# EAGLE design bluetoot_relay (EAGLE 7.4.0)
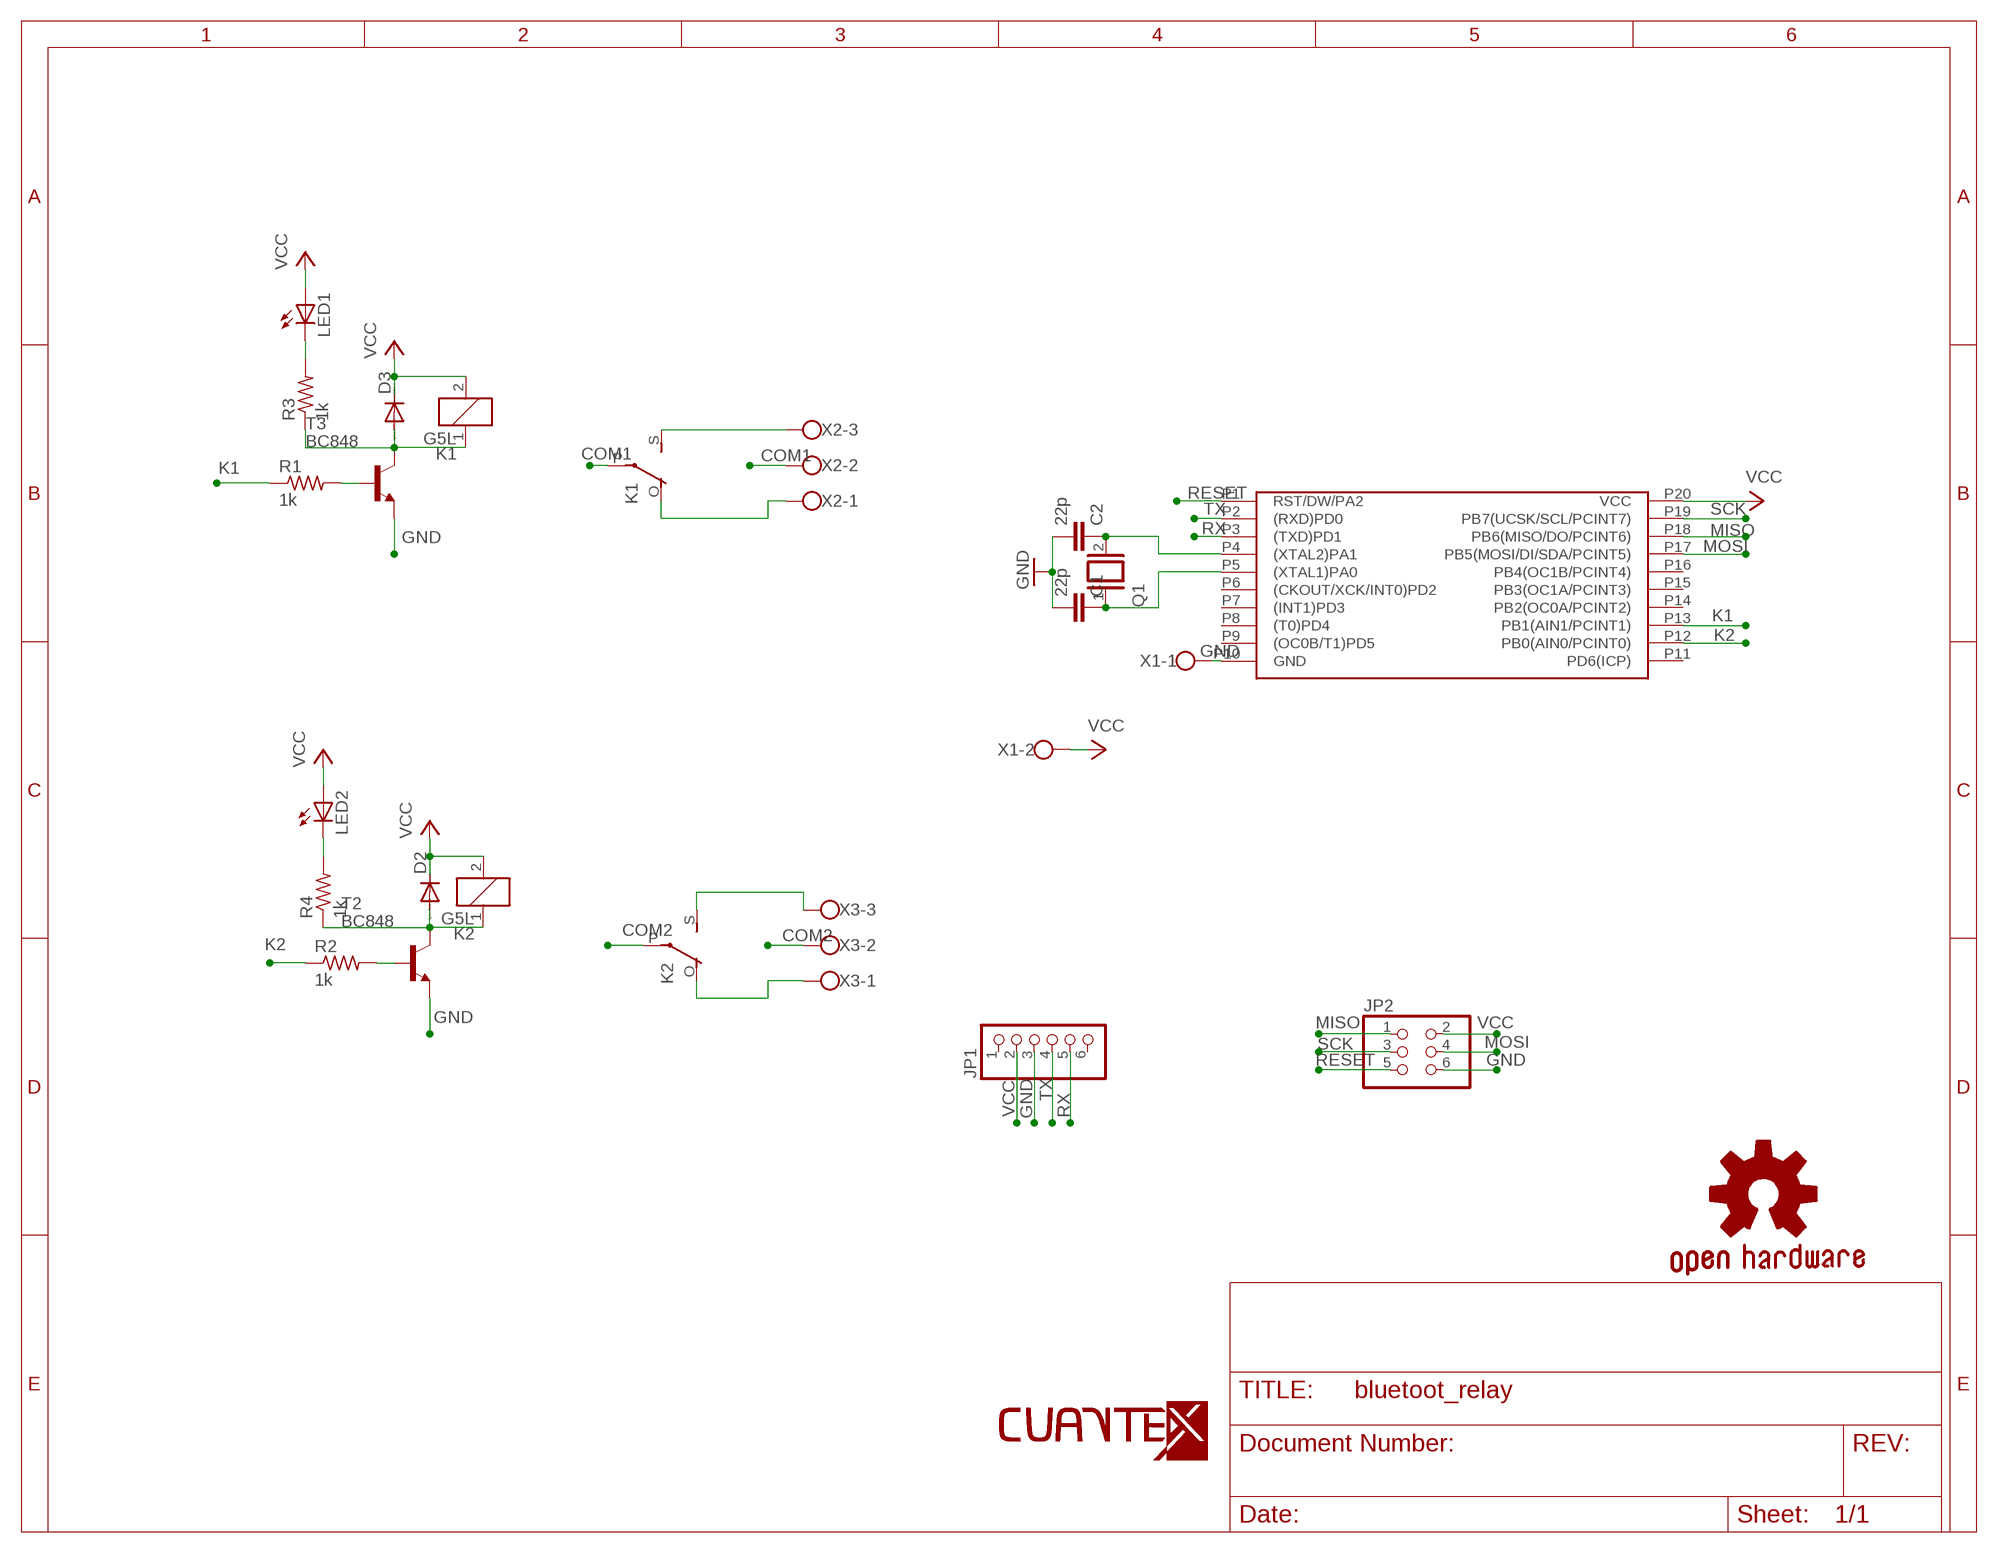
[diagram p0: schematic, sheet 1]

## Parts
C1  22p  C-EUC0603  [C0603]
C2  22p  C-EUC0603  [C0603]
D2  DIODE-SMB  [SMB]
D3  DIODE-SMB  [SMB]
GOLD_ORB_SM1  OSHWLOGO_GOLD_ORB_SM  [OSHW2]
JP1  PINHD-1X6  [1X06]
JP2  PINHD-2X3  [2X03]
K1  G5L  [G5LE]
K2  G5L  [G5LE]
LED1  LED0603  [LED-0603]
LED2  LED0603  [LED-0603]
Q1  XTAL/S  [QS]
R1  1k  R-US_R0603  [R0603]
R2  1k  R-US_R0603  [R0603]
R3  1k  R-US_R0603  [R0603]
R4  1k  R-US_R0603  [R0603]
T2  BC848  [SOT23]
T3  BC848  [SOT23]
U$1  ATTYNY2313/V  [SOIC]
U$3  LOGO-TOP-20MM  [C-0]
U$4  LOGO-TOP-50MM  [C-3]
X1  W237-102  [W237-102]
X2  W237-103  [W237-103]
X3  W237-103  [W237-103]

## Nets
COM1: K1.P(2:P) X2.2
COM2: K2.P(2:P) X3.2
GND: C1.2 C2.2 JP1.3 JP2.6 T2.2(E) T3.2(E) U$1.P10(GND) X1.1
K1: R1.1 U$1.P13(PB1(AIN1/PCINT1))
K2: R2.1 U$1.P12(PB0(AIN0/PCINT0))
MISO: JP2.1 U$1.P18(PB6(MISO/DO/PCINT6))
MOSI: JP2.4 U$1.P17(PB5(MOSI/DI/SDA/PCINT5))
N$1: C2.1 Q1.2 U$1.P4((XTAL2)PA1)
N$2: C1.1 Q1.1 U$1.P5((XTAL1)PA0)
N$3: K1.S(2:S) X2.3
N$4: K1.O(2:O) X2.1
N$5: K2.S(2:S) X3.3
N$6: D3.A K1.1 R3.1 T3.3(C)
N$7: K2.O(2:O) X3.1
N$9: LED1.C R3.2
N$10: R1.2 T3.1(B)
N$13: D2.A K2.1 R4.1 T2.3(C)
N$14: R2.2 T2.1(B)
N$15: LED2.C R4.2
RESET: JP2.5 U$1.P1(RST/DW/PA2)
RX: JP1.5 U$1.P3((TXD)PD1)
SCK: JP2.3 U$1.P19(PB7(UCSK/SCL/PCINT7))
TX: JP1.4 U$1.P2((RXD)PD0)
VCC: D2.C D3.C JP1.2 JP2.2 K1.2 K2.2 LED1.A LED2.A U$1.P20(VCC) X1.2
Unconnected: JP1.1 JP1.6 U$1.P6((CKOUT/XCK/INT0)PD2) U$1.P7((INT1)PD3) U$1.P8((T0)PD4) U$1.P9((OC0B/T1)PD5) U$1.P11(PD6(ICP)) U$1.P14(PB2(OC0A/PCINT2)) U$1.P15(PB3(OC1A/PCINT3)) U$1.P16(PB4(OC1B/PCINT4))

## Library data of the parts
C1 C2 = rcl:C-EU: CAPACITOR, European symbol
D2 D3 = diode:DIODE-: DIODE
GOLD_ORB_SM1 = bfl:OSHWLOGO: These are Open-Source Hardware logos.
JP1 = adafruit:PINHD-1X6: PIN HEADER
JP2 = pinhead:PINHD-2X3: PIN HEADER
K1 K2 = relay:G5L: RELAY 1 x switch, 10 A/120 V AC, 8 A/30 V ADC, Omron; OC_FARNELL: unknown; OC_NEWARK: unknown
LED1 LED2 = SparkFun:LED: LEDs Standard schematic elements and footprints for 5mm, 3mm, 1206, and 0603 sized LEDs. 5mm - Spark Fun Electronics SKU : COM-00529 (and others)
Q1 = special:XTAL/S: CRYSTAL
R1-R4 = rcl:R-US_: RESISTOR, American symbol
T2 T3 = transistor:BC848: NPN TRANSISTOR
U$1 = atmel-plus:ATTYNY2313/V
U$3 = LOGOTIPOS:LOGO-TOP-20MM
U$4 = LOGOTIPOS:LOGO-TOP-50MM
X1 = con-wago-500:W237-102: WAGO SCREW CLAMP; MPN: 237-102; OC_FARNELL: unknown; OC_NEWARK: 70K9898
X2 X3 = con-wago-500:W237-103: WAGO SCREW CLAMP; MPN: 237-103; OC_FARNELL: unknown; OC_NEWARK: 18M7116

## Board
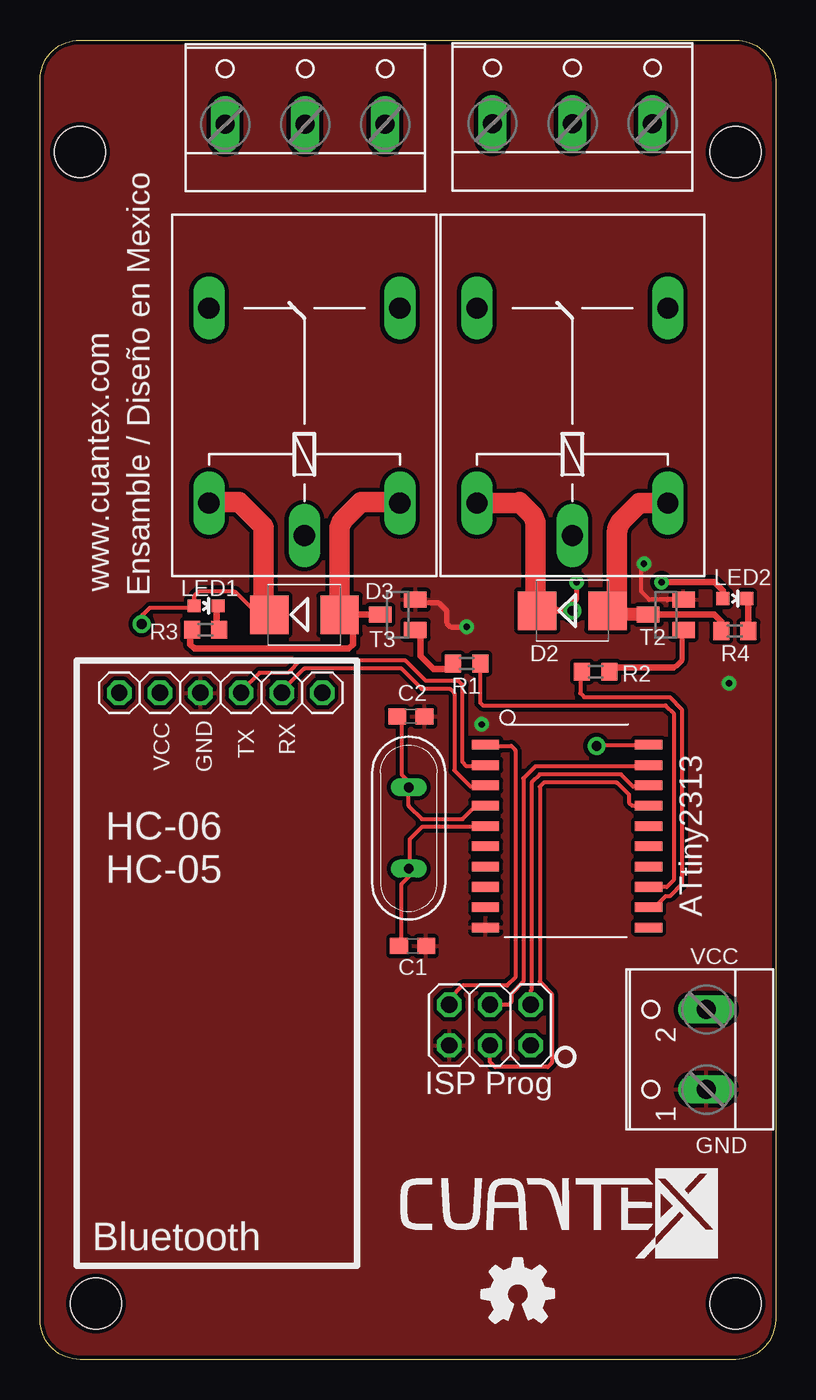
[diagram p1: board, top side]
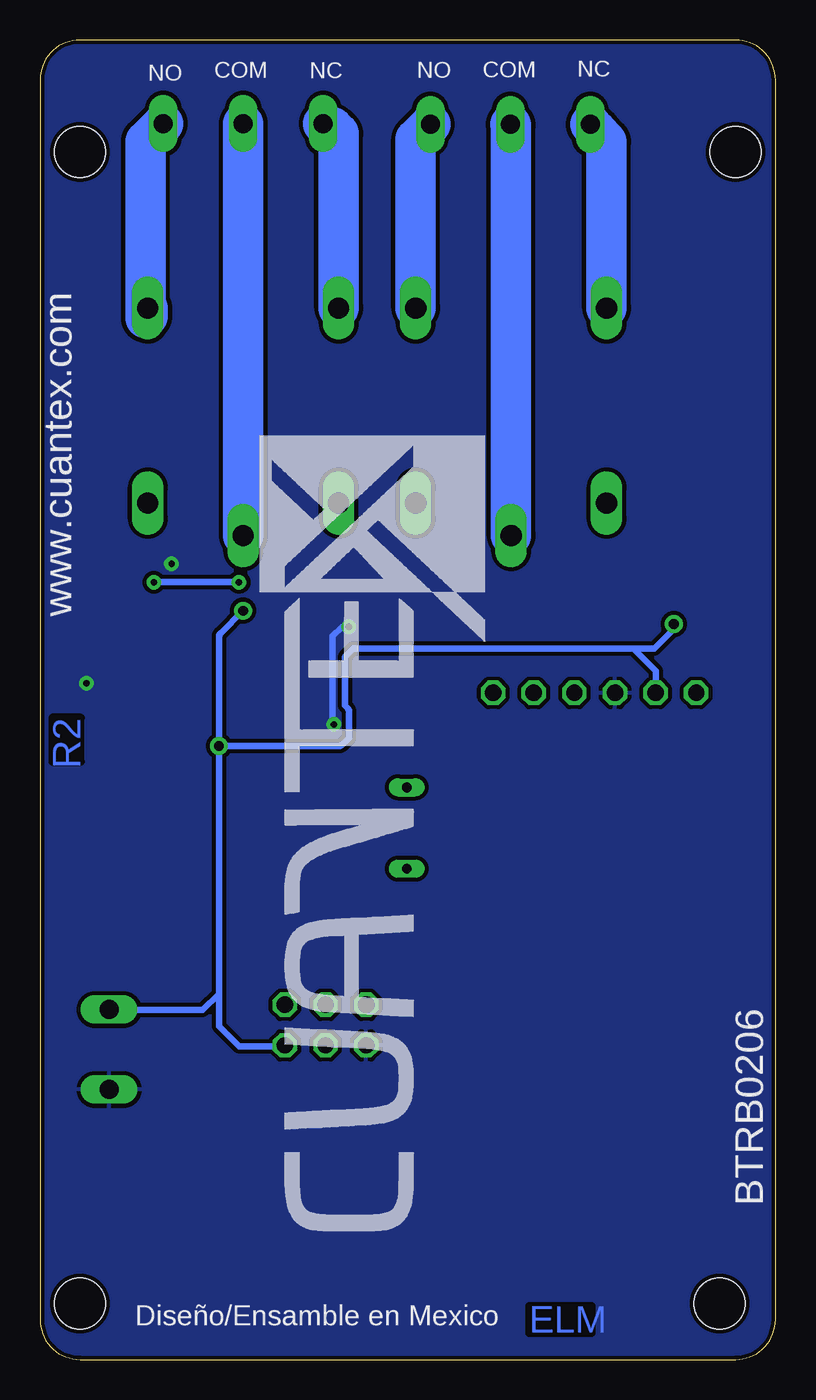
[diagram p2: board, bottom side, seen from below]

Size 46 x 82.5 mm. Coordinates in mm from the lower left corner, seen from the top.
Outline: 46,80 46,2.5 arc-90 43.5,0 2.5,0 arc-90 0,2.5 0,80 arc-90 2.5,82.5 43.5,82.5 arc-90 46,80
Copper layers (1*16): Top 0.035mm / dielectric 1.5mm / Bottom 0.035mm
Design rules "cuantex2layerdrc": minimum track width 8mil, minimum drill 0.3mm, track to track 8mil, track to pad 8mil, pad to pad 8mil, via to via 8mil, smd to smd 8mil, copper to edge 10mil, drill to drill 10mil, minimum pad ring 10mil, minimum via ring 10mil, stop-mask expansion 4mil, vias tented up to drill 0mil, thermal gap 10mil
Holes 3.2 mm at 2.5,75.5 43.5,75.5 43.5,3.5 3.5,3.5

### Footprints (pad centres in the part's own frame; a part is rotated, then mirrored left to right if it is on the bottom)
C0603 = smd 1.1 x 1: 1 -0.85,0; 2 0.85,0
SMB = smd 2.4 x 2.4: A 2.2,0; C -2.2,0
1X06 = drill 1.016 octagon: 1 -6.35,0; 2 -3.81,0; 3 -1.27,0; 4 1.27,0; 5 3.81,0; 6 6.35,0
2X03 = drill 1.016 octagon: 1 -2.54,-1.27; 2 -2.54,1.27; 3 0,-1.27; 4 0,1.27; 5 2.54,-1.27; 6 2.54,1.27
G5LE = drill 1.321 long: 1 -7.493,-5.969; 2 -7.493,5.969; O 4.699,5.969; P -9.525,0; S 4.699,-5.969
LED-0603 = smd 0.8 x 0.8: A 0,-0.75; C 0,0.75
QS = drill 0.61 long: 1 -2.54,0; 2 2.54,0
R0603 = smd 1 x 1.1: 1 -0.85,0; 2 0.85,0
SOT23 = smd 1 x 1.4: 1 -0.95,-1.1; 2 0.95,-1.1; 3 0,1.1
SOIC = smd 1.7 x 0.6: P1 -5.1,5.08; P2 -5.1,3.81; P3 -5.1,2.54; P4 -5.1,1.27; P5 -5.1,0; P6 -5.1,-1.27; P7 -5.1,-2.54; P8 -5.1,-3.81; P9 -5.1,-5.08; P10 -5.1,-6.35; P11 5.1,-6.35; P12 5.1,-5.08; P13 5.1,-3.81; P14 5.1,-2.54; P15 5.1,-1.27; P16 5.1,0; P17 5.1,1.27; P18 5.1,2.54; P19 5.1,3.81; P20 5.1,5.08
W237-102 = drill 1.194 long: 1 -2.5,-1.27; 2 2.5,-1.27
W237-103 = drill 1.194 long: 1 -5,-1.29; 2 0,-1.29; 3 5,-1.29

### Placement (x,y rotation side)
C1  23.3,25.85 0 top
C2  23.2,40.2 0 top
D2  33.3,46.82 0 top
D3  16.53,46.56 0 top
GOLD_ORB_SM1  26.06,-0.2 0 top
JP1  11.31,41.68 0 top
JP2  28.14,20.91 180 top
K1  16.53,61.04 90 top
K2  33.3,61.04 90 top
LED1  10.39,47.12 270 top
LED2  43.46,47.58 270 top
Q1  23.06,33.23 90 top
R1  26.69,43.52 180 top
R2  34.74,43.01 0 top
R3  10.36,45.62 0 top
R4  43.46,45.55 0 top
T2  39.14,46.56 90 top
T3  22.37,46.56 90 top
U$1  32.97,33.36 0 top
U$3  22.5,6.28 0 top
U$4  18.04,7.88 90 bottom
X1  40.41,19.39 90 top
X2  16.58,78.52 0 top
X3  33.3,78.57 0 top

### Tracks (layer width: path | path; a pad name or v marks a point on that pad's centre or on a via)
COM1
  Bottom 2.54: K1.P 16.53,77.18 X2.2
COM2
  Bottom 2.54: X3.2 K2.P
GND  (via drill 0.4)
  Top 0.254: v37.77,49.75 37.77,49.77 37.6,49.59 37.6,48.02 38.11,47.51 39.22,47.51 39.23,47.51
  Top 0.305: T3.2 23.66,47.33 24.91,47.33 25.42,46.82 25.42,46.06 25.68,45.8 v26.69,45.8 | T2.2 39.23,47.51
  Bottom 0.406: 26.95,45.8 v26.69,45.8 27.11,45.8 27.69,45.22 27.69,39.51
  other vias: 27.63,39.71 43.1,42.27
  pour Top (isolate 0.254): 0,82.5 46,82.5 46,0 0,0
  pour Bottom (isolate 0.254): 0,82.5 46,82.5 46,0 0,0
K1
  Top 0.254: R1.1 27.54,41.05 27.69,40.9 39.12,40.9 39.63,40.39 39.63,29.98 39.2,29.55 U$1.P13
K2
  Top 0.254: R2.1 33.79,42.9 33.79,41.66 34.04,41.41 39.38,41.41 40.14,40.65 40.14,29.73 39.38,28.96 39.12,28.96 38.53,28.37 arc-45 38.3,28.28 U$1.P12 38.07,28.41
MISO
  Top 0.254: U$1.P18 37.99,35.82 37.09,35.82 36.33,36.58 31.25,36.58 30.74,36.08 30.74,23.12 30.68,23.06 JP2.1
MOSI
  Top 0.254: U$1.P17 37.99,34.55 | JP2.4 28.14,18.61 28.46,18.3 31.76,18.3 32.01,18.55 32.01,22.87 31.25,23.63 31.25,35.82 31.5,36.08 36.08,36.08 36.84,35.31 36.84,34.81 37.02,34.63 U$1.P17 | 37.78,34.63 U$1.P17
N$1
  Top 0.254: U$1.P4 27.26,34.63 26.42,33.79 23.88,33.79 23.06,34.61 Q1.2 23.06,36.14 22.61,36.58 22.61,39.93 C2.1
N$2
  Top 0.254: C1.1 22.61,26.02 22.61,29.73 23.06,30.17 Q1.1 23.12,30.75 23.12,32.52 23.88,33.28 27.79,33.28 U$1.P5
N$3
  Bottom 2.54: K1.S 22.5,76.31 X2.3
N$4
  Bottom 2.54: K1.O 10.56,76.16 11.2,76.79 11.2,76.84 X2.1
N$5
  Bottom 2.54: K2.S 39.27,65.23 39.39,65.11 39.39,76.18 X3.3
N$6
  Top 0.406: R3.1 9.41,45.52 9.41,44.71 9.66,44.46 19.31,44.46 19.57,44.71 19.57,45.47 18.73,46.31 D3.A T3.3
  Top 1.27: K1.1 arc45 22.37,53.6 20.07,53.6 19.02,52.55 arc45 18.73,51.85 D3.A
N$7
  Bottom 2.54: K2.O 27.33,76.66 27.71,77.04 28.06,77.04 X3.1
N$9
  Top 0.406: LED1.C 11.03,47.23 11.03,45.8 R3.2
N$10
  Top 0.406: R1.2 25.78,43.52 25.42,43.16 24.61,43.16 23.8,43.97 23.8,45.29 T3.1
N$13
  Top 0.406: 35.75,46.56 D2.A | R4.1 42.61,46.14 42.19,46.56 T2.3
  Top 0.813: T2.3 36.08,46.56 35.75,46.56
  Top 1.27: K2.1 37.49,53.55 36.45,52.51 arc45 36.08,51.61 36.08,46.56 | 35.84,47.16 D2.A
N$14
  Top 0.254: R2.2 35.85,43.26 | 40.05,45.43 40.07,45.41 arc-45 40.14,45.24 | 39.78,43.34 arc-45 39.6,43.26
  Top 0.305: 40.14,45.24 40.14,43.7 39.78,43.34
  Top 0.406: 35.85,43.26 39.6,43.26 | 40.05,45.43 T2.1
N$15
  Top 0.406: LED2.C 44.31,47.58 R4.2
RESET
  Top 0.254: U$1.P1 27.94,38.36 29.47,38.36 29.73,38.11 29.73,23.88 29.22,23.38 26.42,23.38 25.6,22.55 JP2.5
RX
  Top 0.254: U$1.P3 27.26,35.9 27.19,35.82 26.93,35.82 25.92,36.84 25.92,41.66 25.66,41.92 23.88,41.92 22.61,43.19 16.52,43.19 15.12,41.79 JP1.5
SCK
  Top 0.254: JP2.3 29.29,22.18 29.47,22.36 29.47,22.87 30.23,23.63 30.23,36.33 31,37.09 37.99,37.09 U$1.P19
TX
  Top 0.254: U$1.P2 27.79,37.09 26.68,37.09 26.42,37.35 26.42,42.17 26.17,42.43 24.14,42.43 22.87,43.7 16.26,43.7 15.5,42.93 13.72,42.93 12.58,41.79 JP1.4
VCC  (via drill 0.4, 0.6)
  Top 0.254: v34.81,38.36 34.88,38.44 U$1.P20 | D2.C 31.41,47.13 arc45 31.5,47.36 31.5,47.76 32.43,46.84 arc45 32.65,46.74 33.28,46.74 | v6.36,45.98 6.36,46.36 arc-45 6.45,46.58 6.87,47 9.38,47 arc45 9.6,47.09 LED1.A 9.64,47.6 arc-45 9.73,47.83 9.91,48.01 12.07,48.01 arc-45 12.29,47.92 13.98,46.24
  Top 0.305: v33.55,48.6 arc45 33.54,48.56 33.54,47.51 33.39,47.36 arc45 33.3,47.13 v33.3,46.82
  Top 0.406: LED2.A 42.71,48.08 42.19,48.6 v38.87,48.6 | v33.3,46.82 D2.C
  Top 1.27: D2.C 31.1,47.26 arc45 31,47.51 31,52.17 arc45 30.7,52.88 29.98,53.6 29.93,53.55 K2.2 | K1.2 arc-45 10.69,53.6 12.45,53.6 13.88,52.17 arc-45 13.98,51.95 13.98,46.24 14.29,46.55 arc-45 D3.C
  Bottom 0.254: v6.36,45.98 arc45 6.26,45.76
  Bottom 0.406: v38.87,48.6 v33.55,48.6 | X1.2 41.65,21.85 35.82,21.85 34.81,22.87 | v34.81,38.36 34.81,45.18 arc45 34.71,45.4 v33.3,46.82 | 34.81,22.87 v34.81,38.36 | JP2.2 30.75,19.57 33.54,19.57 34.81,20.84 34.81,22.87 | K2.2 27.35,53.57 arc45 27.44,53.79 27.44,53.86 | 8.9,44.46 26.42,44.46 26.84,44.04 arc-45 26.93,43.82 26.93,40.9 26.77,40.74 arc45 26.68,40.52 26.68,38.87 27.09,38.45 arc45 27.32,38.36 v34.81,38.36 | 6.26,45.76 7.56,44.46 8.9,44.46 | 8.9,44.46 7.5,43.06 JP1.2

### Text on the board
Bottom: R2 | ELM
tPlace: www.cuantex.com | Ensamble / Diseño en Mexico | HC-06 | HC-05 | ATtiny2313 | ISP Prog | Bluetooth
tNames: VCC | GND | TX | RX | VCC | GND
bNames: NC | COM | NO | NC | COM | NO | www.cuantex.com | BTRB0206 | Diseño/Ensamble en Mexico